# Altium schematic sheet 3796.SchDoc
size A4
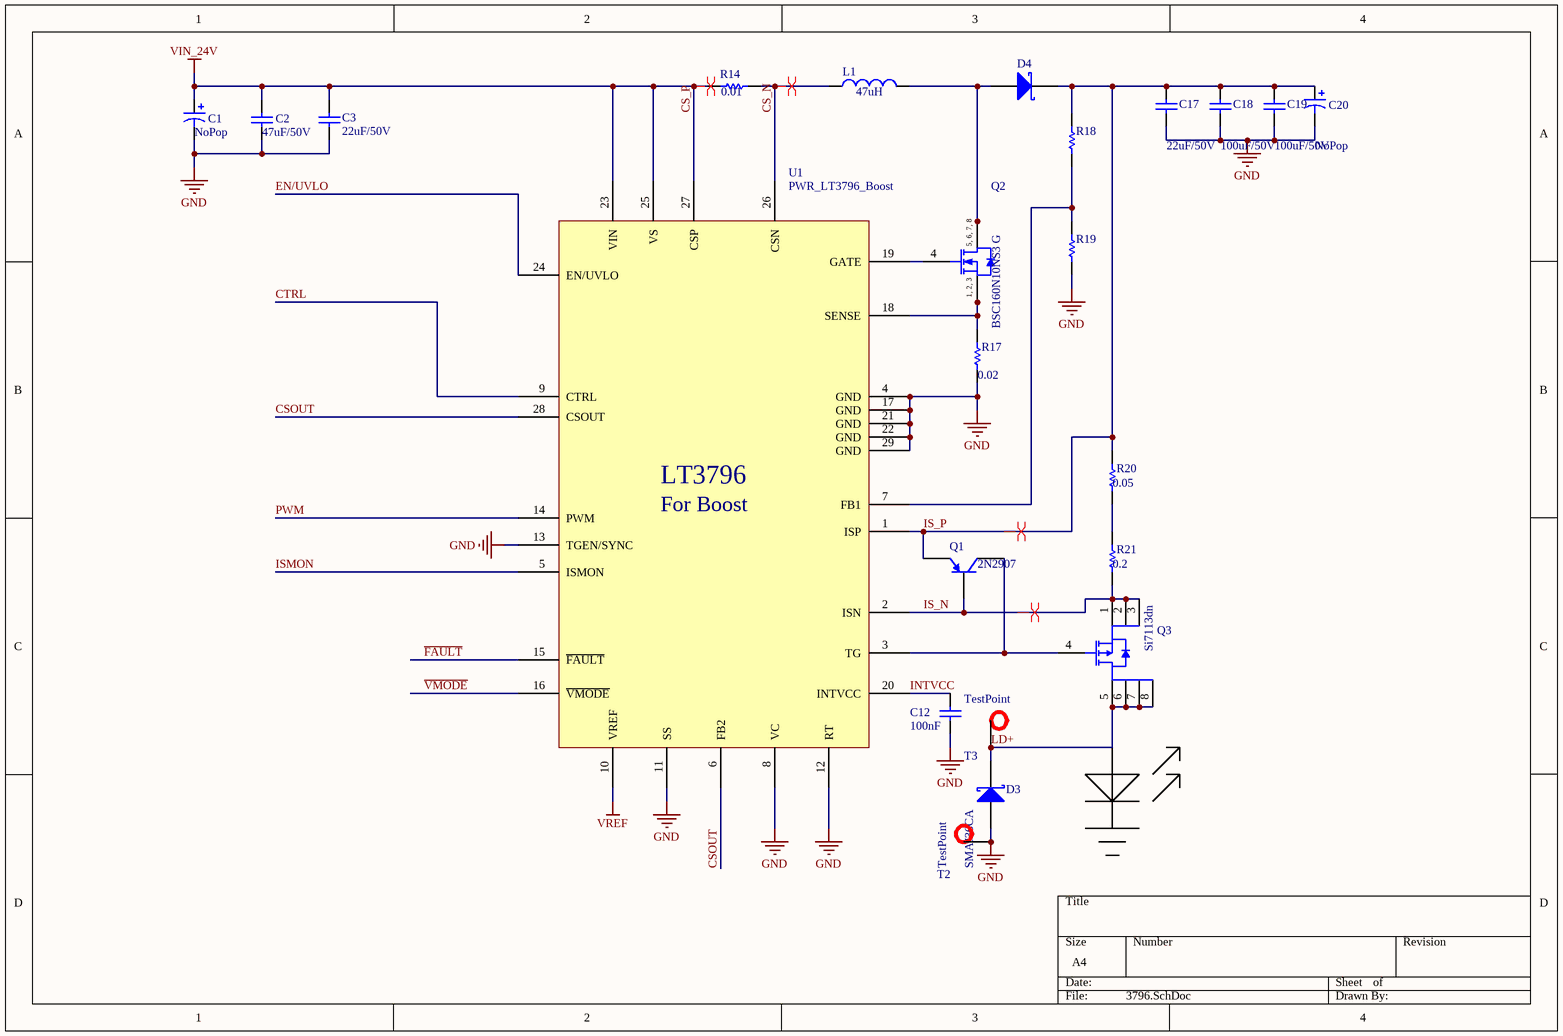
[diagram p0: 3796.SchDoc]

## Parts
C1  NoPop  [SMC_Altium Capacity 8*10]
C2  47uF/50V  [1206[3216] - NP]
C3  22uF/50V  [1206[3216] - NP]
C12  100nF  [1608[0603]]
C17  22uF/50V  [1206[3216] - NP]
C18  100uF/50V  [1206[3216] - NP]
C19  100uF/50V  [1206[3216] - NP]
C20  NoPop  [SMC_Altium Capacity 8*10]
D3  SMAJ36CA  [SMA_DIOM5226X26N]
D4  (no value)  [PowerDI5]
L1  value 47uH  [IHLP4040]  (hidden comment: IHLP-4040DZ-11)
Q1  2N2907  [SOT95P280X115-3N]
Q2  BSC160N10NS3 G  [INF-PG-TDSON-8-1_V]
Q3  Si7113dn  [1212-8 Single]
R14  0.01  [2512[6432]]
R17  0.02  [2512[6432]]
R18  (no value)  [1608[0603]]
R19  (no value)  [1608[0603]]
R20  0.05  [2512[6432]]
R21  0.2  [2512[6432]]
T2  Test Point  [TestPoint]  (value not drawn)
T3  Test Point  [TestPoint]  (value not drawn)
U1  PWR_LT3796_Boost  [TSOP65P640X120_HS-29N]

## Nets
CS_P: C1.1 C2.2 C3.2 R14.1 U1.23(VIN) U1.25(VS) U1.27(CSP)  [also labelled VIN_24V]
GND: C1.2 C2.1 C3.1 C12.2 C17.1 C18.1 C19.1 C20.2 D3.1(A) R17.1 R19.2 T2.1(TP) U1.4(GND) U1.8(VC) U1.11(SS) U1.12(RT) U1.13(TGEN/SYNC) U1.17(GND) U1.21(GND) U1.22(GND) U1.29(GND)
VREF: U1.10(VREF)
CS_N: L1.1 R14.2 U1.26(CSN)
CSOUT: U1.6(FB2) U1.28(CSOUT)
CTRL: U1.9(CTRL)
EN/UVLO: U1.24(EN/UVLO)
~{FAULT}: U1.15(~{FAULT})
INTVCC: C12.1 U1.20(INTVCC)
IS_N: Q1.2(B) Q3.1(SOURCE) Q3.2(SOURCE) Q3.3(SOURCE) R21.1 U1.2(ISN)
IS_P: C17.2 C18.2 C19.2 C20.1 D4.2(K) Q1.1(E) R18.2 R20.2 U1.1(ISP)
ISMON: U1.5(ISMON)
LD+: D3.2(K) Q3.5(DRAIN) Q3.6(DRAIN) Q3.7(DRAIN) Q3.8(DRAIN) T3.1(TP)
PWM: U1.14(PWM)
~{VMODE}: U1.16(~{VMODE})
NetD4_1: D4.1(A) L1.2 Q2.5(DRAIN) Q2.6(DRAIN) Q2.7(DRAIN) Q2.8(DRAIN)
NetQ1_3: Q1.3(C) Q3.4(GATE) U1.3(TG)
NetQ2_1: Q2.1(SOURCE) Q2.2(SOURCE) Q2.3(SOURCE) R17.2 U1.18(SENSE)
NetQ2_4: Q2.4(GATE) U1.19(GATE)
NetR18_1: R18.1 R19.1 U1.7(FB1)
NetR20_1: R20.1 R21.2

## Layout directives
differential pair: CS_N, CS_P, IS_N, IS_P

## Notes on the sheet
- (in symbol BSC160N10NS3 G) 5, 6, 7, 8; 1, 2, 3
- (in symbol PWR_LT3796_Boost) LT3796; For Boost
- (in symbol TP) TestPoint

## Library data of the parts
C1 C20 = Cap Pol1: Polarized Capacitor (Radial); Value: 100uF/50V; Published: 8-Jun-2000; LatestRevisionDate: 17-Jul-2002; LatestRevisionNote: Re-released for DXP Platform.; PackageReference: RB7.6-15; Publisher: Altium Limited; PackageDescription: Polarized Capacitor (Radial); 2 Leads
C2 C3 C12 C17-C19 = Cap: Capacitor; Published: 8-Jun-2000; LatestRevisionDate: 17-Jul-2002; LatestRevisionNote: Re-released for DXP Platform.; PackageReference: RAD-0.3; Publisher: Altium Limited; PackageDescription: Radial Cap, Thru-Hole; 2 Leads; 0.3 in Pin Spacing
  C2: Value: 47uF/50V
  C3 C17: Value: 22uF/50V
  C12: Value: 100nF
  C18 C19: Value: 100uF/50V
D3 D4 = D Schottky: Schottky Diode; Published: 8-Jun-2000; LatestRevisionDate: 17-Jul-2002; LatestRevisionNote: Re-released for DXP Platform.; PackageReference: SMB; Publisher: Altium Limited; PackageDescription: DO-214-AA/SMB; 2 C-Bend Leads; Body 5.3 x 3.6 mm, inc. leads (LxW); Code_JEDEC: DO-214-AA
L1 = Inductor: Code_IEC: 1005; Published: 8-Jun-2000; LatestRevisionDate: 29-May-2009; LatestRevisionNote: IPC-7351 Footprint Added.; PackageReference: 0402-A; Publisher: Altium Limited; PackageDescription: Chip Inductor; Code_JEITA: 0402
Q1 = 2N3906: PNP General Purpose Amplifier; Published: 8-Jun-2000; LatestRevisionDate: 15-Jan-2003; LatestRevisionNote: PCB Footprint 'BCY-W3/D4.7' replaced; DatasheetVersion: 1997; PackageVersion: Sep-1998; PackageReference: TO-92A; Publisher: Altium Limited; PackageDescription: TO, Flat Index; 3 In-Line, Axial Leads; Body Dia. 4.5mm; Leads 0.51 x 0.48 mm (max); ComponentLink1Description: Manufacturer Link; ComponentLink1URL: http://www.fairchildsemi.com/; ComponentLink2Description: Datasheet; ComponentLink2URL: http://www.fairchildsemi.com/ds/2N%2F2N3906.pdf
Q2 = BSC160N10NS3 G: N-Channel OptiMOS 3 Power-Transistor, 100 V VDS, 42 A ID, -55 to 150 degC, PG-TDSON-8-1, Reel, Green; Manufacturer: Infineon; Green: TRUE; ID (max): 42 A; IDpuls (max): 168 A; Polarity: N; Ptot (max): 60 W; QG: 19 nC; RDS (on) (max): 16 mOhm; Rth: 2.1 K/W; RthJA (max): 50 K/W; VDS (max): 100 V; VGS(th) (max): 3.5 V; VGS(th) (min): 2 V; DatasheetVersion: Rev. 2.4; PackageReference: PG-TDSON-8-1; PackageDescription: 8-Pin Plastic (Green) Thin Dual Small Outline Non-Leaded Package, 5.15 x 5.9 mm Body, 1.27 mm Pitch; Supplier 1: Digi-Key; Supplier Part Number 1: BSC160N10NS3 GINTR-ND; Supplier 2: Digi-Key; Supplier Part Number 2: BSC160N10NS3 GINCT-ND; Supplier 3: Digi-Key; Supplier Part Number 3: BSC160N10NS3 GINDKR-ND; Supplier 4: Mouser; Supplier Part Number 4: 726-BSC160N10NS3G; Halogen-free: TRUE; Packing: Reel; RthJC (max): 2.1 K/W; Mounting Technology: Surface Mount; PartNumber: BSC160N10NS3 G; ComponentLink1Description: Manufacturer URL; ComponentLink1URL: http://www.infineon.com/; ComponentLink2Description: Datasheet; ComponentLink2URL: http://www.infineon.com/dgdl/BSC160N10NS3+Rev2.4.pdf?folderId=db3a304313b8b5a60113cee8763b02d7&fileId=db3a30432239cccd01226040189a7f47; ComponentLink3Description: Package Specification; ComponentLink3URL: http://www.infineon.com/cms/packages/SMD_-_Surface_Mounted_Devices/P-PG-TDSON/P-PG-TDSON-08-01x_2x_3.html?__locale=en
Q3 = PWR_ Si7113dn: PMOS, Si7113dn; Manufacturer: Infineon; PartNumber: BSC160N10NS3 G; Green: TRUE; ID (max): 42 A; IDpuls (max): 168 A; Packing: Reel; Polarity: N; Ptot (max): 60 W; QG: 19 nC; RDS (on) (max): 16 mOhm; Rth: 2.1 K/W; RthJA (max): 50 K/W; VDS (max): 100 V; VGS(th) (max): 3.5 V; VGS(th) (min): 2 V; DatasheetVersion: Rev. 2.4; PackageReference: PG-TDSON-8-1; PackageDescription: 8-Pin Plastic (Green) Thin Dual Small Outline Non-Leaded Package, 5.15 x 5.9 mm Body, 1.27 mm Pitch; Supplier 1: Digi-Key; Supplier Part Number 1: BSC160N10NS3 GINTR-ND; Supplier 2: Digi-Key; Supplier Part Number 2: BSC160N10NS3 GINCT-ND; Supplier 3: Digi-Key; Supplier Part Number 3: BSC160N10NS3 GINDKR-ND; Supplier 4: Mouser; Supplier Part Number 4: 726-BSC160N10NS3G; Halogen-free: TRUE; RthJC (max): 2.1 K/W; Mounting Technology: Surface Mount; ComponentLink1Description: Manufacturer URL; ComponentLink1URL: http://www.infineon.com/; ComponentLink2Description: Datasheet; ComponentLink2URL: http://www.infineon.com/dgdl/BSC160N10NS3+Rev2.4.pdf?folderId=db3a304313b8b5a60113cee8763b02d7&fileId=db3a30432239cccd01226040189a7f47; ComponentLink3Description: Package Specification; ComponentLink3URL: http://www.infineon.com/cms/packages/SMD_-_Surface_Mounted_Devices/P-PG-TDSON/P-PG-TDSON-08-01x_2x_3.html?__locale=en
R14 = Res1: Resistor; Value: 10m; Published: 8-Jun-2000; LatestRevisionDate: 17-Jul-2002; LatestRevisionNote: Re-released for DXP Platform.; PackageReference: AXIAL-0.3; Publisher: Altium Limited; PackageDescription: Axial Device, Thru-Hole; 2 Leads; 0.3 in Pin Spacing
R17 = Res1: Resistor; Value: 20m; Published: 8-Jun-2000; LatestRevisionDate: 17-Jul-2002; LatestRevisionNote: Re-released for DXP Platform.; PackageReference: AXIAL-0.3; Publisher: Altium Limited; PackageDescription: Axial Device, Thru-Hole; 2 Leads; 0.3 in Pin Spacing
R18 = Res1: Resistor; Value: 620K; Published: 8-Jun-2000; LatestRevisionDate: 17-Jul-2002; LatestRevisionNote: Re-released for DXP Platform.; PackageReference: AXIAL-0.3; Publisher: Altium Limited; PackageDescription: Axial Device, Thru-Hole; 2 Leads; 0.3 in Pin Spacing
R19 = Res1: Resistor; Value: 20K; Published: 8-Jun-2000; LatestRevisionDate: 17-Jul-2002; LatestRevisionNote: Re-released for DXP Platform.; PackageReference: AXIAL-0.3; Publisher: Altium Limited; PackageDescription: Axial Device, Thru-Hole; 2 Leads; 0.3 in Pin Spacing
R20 = Res1: Resistor; Value: 50m; Published: 8-Jun-2000; LatestRevisionDate: 17-Jul-2002; LatestRevisionNote: Re-released for DXP Platform.; PackageReference: AXIAL-0.3; Publisher: Altium Limited; PackageDescription: Axial Device, Thru-Hole; 2 Leads; 0.3 in Pin Spacing
R21 = Res1: Resistor; Value: 200m; Published: 8-Jun-2000; LatestRevisionDate: 17-Jul-2002; LatestRevisionNote: Re-released for DXP Platform.; PackageReference: AXIAL-0.3; Publisher: Altium Limited; PackageDescription: Axial Device, Thru-Hole; 2 Leads; 0.3 in Pin Spacing
T2 T3 = TP
U1 = PWR_LT3796_Boost: 100V Constant-Current and   Constant-Voltage Controller   with Dual Current Sense